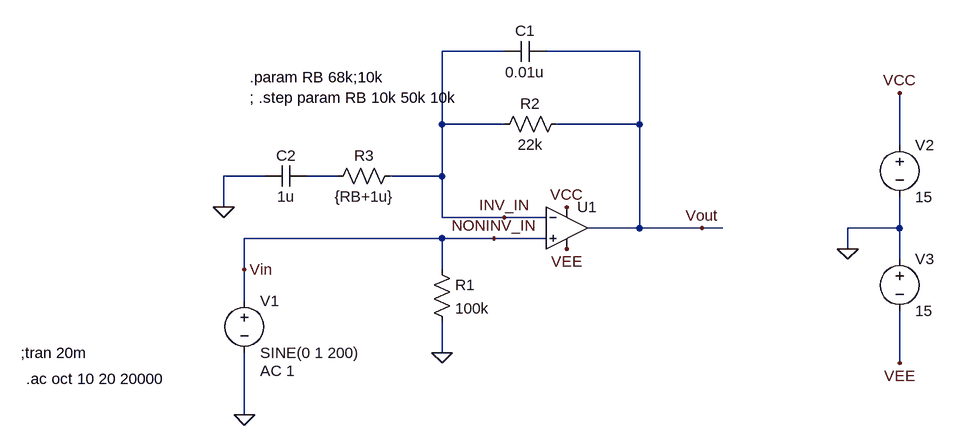
[diagram p0: schematic SD-1W_ToneBoost.asc]
SD-1W_ToneBoost.asc, the LTspice schematic file:
Version 4
SHEET 1 880 680
WIRE -208 -160 -304 -160
WIRE 0 -160 -144 -160
WIRE -304 -48 -304 -160
WIRE -208 -48 -304 -48
WIRE 0 -48 0 -160
WIRE 0 -48 -128 -48
WIRE 400 -16 400 -96
WIRE -576 32 -640 32
WIRE -464 32 -512 32
WIRE -304 32 -304 -48
WIRE -304 32 -384 32
WIRE -640 80 -640 32
WIRE -304 96 -304 32
WIRE -208 96 -304 96
WIRE -144 96 -208 96
WIRE 0 112 0 -48
WIRE 0 112 -80 112
WIRE 96 112 0 112
WIRE 128 112 96 112
WIRE 400 112 400 64
WIRE 400 112 320 112
WIRE -304 128 -608 128
WIRE -224 128 -304 128
WIRE -144 128 -224 128
WIRE 320 144 320 112
WIRE 400 160 400 112
WIRE -608 176 -608 128
WIRE -304 176 -304 128
WIRE -608 224 -608 176
WIRE -304 304 -304 256
WIRE 400 320 400 240
WIRE -608 400 -608 304
FLAG -608 400 0
FLAG 320 144 0
FLAG 400 -96 VCC
FLAG 400 320 VEE
FLAG -112 144 VEE
FLAG -112 80 VCC
FLAG -208 96 INV_IN
FLAG -224 128 NONINV_IN
FLAG -640 80 0
FLAG -304 304 0
FLAG -608 176 Vin
FLAG 96 112 Vout
SYMBOL voltage -608 208 R0
WINDOW 123 24 124 Left 2
WINDOW 39 0 0 Left 2
SYMATTR Value2 AC 1
SYMATTR InstName V1
SYMATTR Value SINE(0 1 200)
SYMBOL voltage 400 -32 R0
WINDOW 123 0 0 Left 2
WINDOW 39 0 0 Left 2
SYMATTR InstName V2
SYMATTR Value 15
SYMBOL voltage 400 144 R0
WINDOW 123 0 0 Left 2
WINDOW 39 0 0 Left 2
SYMATTR InstName V3
SYMATTR Value 15
SYMBOL Opamps\\UniversalOpamp2 -112 112 R0
SYMATTR InstName U1
SYMBOL res -320 160 R0
SYMATTR InstName R1
SYMATTR Value 100k
SYMBOL res -112 -64 R90
WINDOW 0 0 56 VBottom 2
WINDOW 3 32 56 VTop 2
SYMATTR InstName R2
SYMATTR Value 22k
SYMBOL res -368 16 R90
WINDOW 0 0 56 VBottom 2
WINDOW 3 32 56 VTop 2
SYMATTR InstName R3
SYMATTR Value {RB+1u}
SYMBOL cap -144 -176 R90
WINDOW 0 0 32 VBottom 2
WINDOW 3 32 32 VTop 2
SYMATTR InstName C1
SYMATTR Value 0.01u
SYMBOL cap -512 16 R90
WINDOW 0 0 32 VBottom 2
WINDOW 3 32 32 VTop 2
SYMATTR InstName C2
SYMATTR Value 1u
TEXT -944 344 Left 2 !.ac oct 10 20 20000
TEXT -952 304 Left 2 !;tran 20m
TEXT -600 -120 Left 2 !.param RB 68k;10k\n; .step param RB 10k 50k 10k

The netlist it stands for:
* SD-1W_ToneBoost.asc
V1 Vin 0 SINE(0 1 200) AC 1
V2 VCC 0 15
V3 0 VEE 15
XU1 Vin INV_IN VCC VEE Vout level.2 Avol=1Meg GBW=10Meg Slew=10Meg ilimit=25m rail=0 Vos=0 phimargin=45 en=0 enk=0 in=0 ink=0 Rin=500Meg  ; pins IN+ IN- V+ V- OUT
R1 Vin 0 100k
R2 Vout INV_IN 22k
R3 INV_IN N001 {RB+1u}
C1 Vout INV_IN 0.01u
C2 N001 0 1u
.ac oct 10 20 20000
;tran 20m
.param RB 68k;10k
; .step param RB 10k 50k 10k
.lib UniversalOpamps2.sub
.backanno
.end